# Altium project frontBreakout.PrjPcb
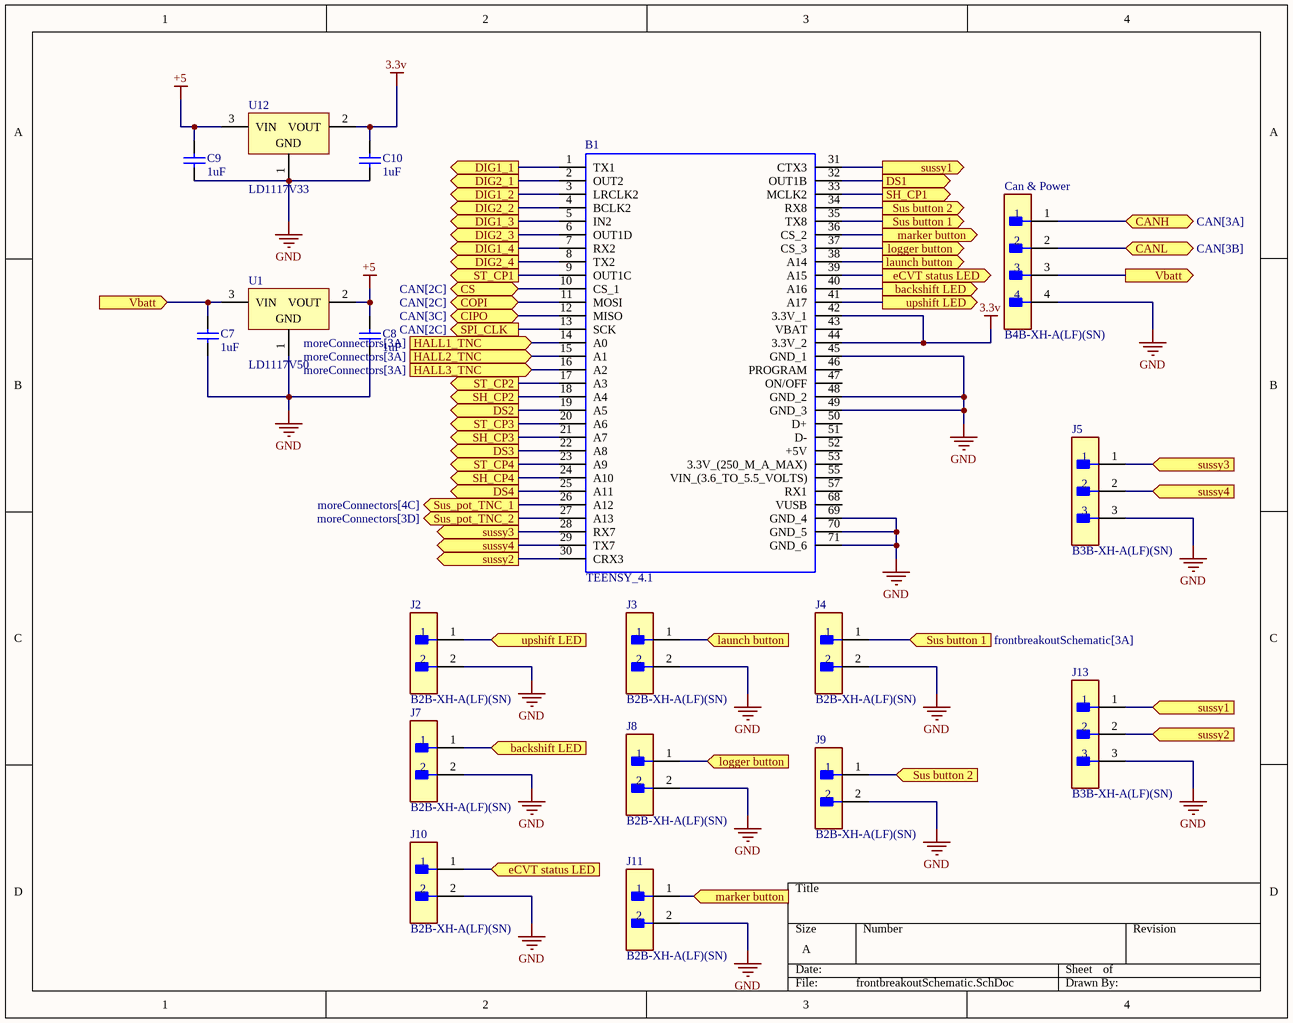
[diagram p0: frontbreakoutSchematic.SchDoc]
5 sheets, 90 parts. Net scope: flat (ports and power ports of the same name join across sheets).
Board file: frontbreakoutPCB.PcbDoc
Sheets:
  frontbreakoutSchematic.SchDoc
  CAN.SchDoc
  ssegs_and_registers.SchDoc
  SEX.SchDoc
  moreConnectors.SchDoc

## Sheet frontbreakoutSchematic.SchDoc
size A; SheetNumber: 1; SheetTotal: 5

### Parts
B1  TEENSY_4.1  [TEENSY41]
C7  1uF  [CAPC2013X145X50LL20T25]
C8  1uF  [CAPC2013X145X50LL20T25]
C9  1uF  [CAPC2013X145X50LL20T25]
C10  1uF  [CAPC2013X145X50LL20T25]
Can_&_Power  B4B-XH-A(LF)(SN)  [FP-B4B-XH-A_LF_SN-MFG]
J2  B2B-XH-A(LF)(SN)  [FP-B2B-XH-A_LF_SN-MFG]
J3  B2B-XH-A(LF)(SN)  [FP-B2B-XH-A_LF_SN-MFG]
J4  B2B-XH-A(LF)(SN)  [FP-B2B-XH-A_LF_SN-MFG]
J5  B3B-XH-A(LF)(SN)  [FP-B3B-XH-A_LF_SN-MFG]
J7  B2B-XH-A(LF)(SN)  [FP-B2B-XH-A_LF_SN-MFG]
J8  B2B-XH-A(LF)(SN)  [FP-B2B-XH-A_LF_SN-MFG]
J9  B2B-XH-A(LF)(SN)  [FP-B2B-XH-A_LF_SN-MFG]
J10  B2B-XH-A(LF)(SN)  [FP-B2B-XH-A_LF_SN-MFG]
J11  B2B-XH-A(LF)(SN)  [FP-B2B-XH-A_LF_SN-MFG]
J13  B3B-XH-A(LF)(SN)  [FP-B3B-XH-A_LF_SN-MFG]
U1  LD1117V50  [TO220]
U12  LD1117V33  [TO220]

### Ports
backshift LED (in, see frontbreakoutSchematic[3B]), backshift LED (out, see frontbreakoutSchematic[2C]), CANH (bidir, see CAN[3A]), CANL (bidir, see CAN[3B]), CIPO (bidir, see CAN[3C]), COPI (bidir, see CAN[2C]), CS (bidir, see CAN[2C]), DIG1_1 (out, see SEX[3A]), DIG1_2 (out, see SEX[3C]), DIG1_3 (out, see SEX[2B]), DIG1_4 (out, see SEX[3C]), DIG2_1 (out, see SEX[1A]), DIG2_2 (out, see SEX[1C]), DIG2_3 (out, see SEX[1B]), DIG2_4 (out, see SEX[1C]), DS1 (out, see ssegs_and_registers[1A]), DS2 (out, see ssegs_and_registers[1C]), DS3 (out, see ssegs_and_registers[3A]), DS4 (out, see ssegs_and_registers[3C]), eCVT status LED (in, see frontbreakoutSchematic[3B]), eCVT status LED (out, see frontbreakoutSchematic[2D]), HALL1_TNC (in, see moreConnectors[3A]), HALL2_TNC (in, see moreConnectors[3A]), HALL3_TNC (in, see moreConnectors[3A]), launch button (in, see frontbreakoutSchematic[3B]), launch button (out, see frontbreakoutSchematic[3C]), logger button (in, see frontbreakoutSchematic[3A]), logger button (out, see frontbreakoutSchematic[3C]), marker button (in, see frontbreakoutSchematic[3A]), marker button (out, see frontbreakoutSchematic[3D]), SH_CP1 (out, see ssegs_and_registers[1A]), SH_CP2 (out, see ssegs_and_registers[1C]), SH_CP3 (out, see ssegs_and_registers[3A]), SH_CP4 (out, see ssegs_and_registers[3C]), SPI_CLK (out, see CAN[2C]), ST_CP1 (out, see ssegs_and_registers[1A]), ST_CP2 (out, see ssegs_and_registers[1B]), ST_CP3 (out, see ssegs_and_registers[3A]), ST_CP4 (out, see ssegs_and_registers[3B]), Sus button 1 (in, see frontbreakoutSchematic[3A]), Sus button 1 (out, see frontbreakoutSchematic[3C]), Sus button 2 (in, see frontbreakoutSchematic[3A]), Sus button 2 (out, see frontbreakoutSchematic[3D]), Sus_pot_TNC_1 (out, see moreConnectors[4C]), Sus_pot_TNC_2 (out, see moreConnectors[3D]), sussy1 (in, see frontbreakoutSchematic[3A]), sussy1 (out, see frontbreakoutSchematic[4C]), sussy2 (in, see frontbreakoutSchematic[2C]), sussy2 (out, see frontbreakoutSchematic[4C]), sussy3 (in, see frontbreakoutSchematic[2C]), sussy3 (out, see frontbreakoutSchematic[4B]), sussy4 (in, see frontbreakoutSchematic[2C]), sussy4 (out, see frontbreakoutSchematic[4B]), upshift LED (in, see frontbreakoutSchematic[3B]), upshift LED (out, see frontbreakoutSchematic[2C]), Vbatt (in, see frontbreakoutSchematic[4B], moreConnectors[1A], moreConnectors[2B], moreConnectors[3A]), Vbatt (out, see frontbreakoutSchematic[1B], moreConnectors[1A], moreConnectors[2B], moreConnectors[3A])

### Nets
3.3v: B1.42(3.3V_1) B1.44(3.3V_2) C10.2 U12.2(VOUT)
+5: C8.2 C9.2 U1.2(VOUT) U12.3(VIN)
GND: B1.45(GND_1) B1.48(GND_2) B1.49(GND_3) B1.69(GND_4) B1.70(GND_5) B1.71(GND_6) C7.1 C8.1 C9.1 C10.1 Can_&_Power.4 J2.2 J3.2 J4.2 J5.3 J7.2 J8.2 J9.2 J10.2 J11.2 J13.3 U1.1(GND) U12.1(GND)
HALL1_TNC: B1.14(A0) ; port HALL1_TNC
HALL2_TNC: B1.15(A1) ; port HALL2_TNC
HALL_TNC: B1.16(A2) ; port HALL3_TNC
Sus_Pot_TNC_1: B1.26(A12) ; port Sus_pot_TNC_1
Sus_pot_TNC_2: B1.27(A13) ; port Sus_pot_TNC_2
NetB1_1: B1.1(TX1) ; port DIG1_1
NetB1_2: B1.2(OUT2) ; port DIG2_1
NetB1_3: B1.3(LRCLK2) ; port DIG1_2
NetB1_4: B1.4(BCLK2) ; port DIG2_2
NetB1_5: B1.5(IN2) ; port DIG1_3
NetB1_6: B1.6(OUT1D) ; port DIG2_3
NetB1_7: B1.7(RX2) ; port DIG1_4
NetB1_8: B1.8(TX2) ; port DIG2_4
NetB1_9: B1.9(OUT1C) ; port ST_CP1
NetB1_10: B1.10(CS_1) ; port CS
NetB1_11: B1.11(MOSI) ; port COPI
NetB1_12: B1.12(MISO) ; port CIPO
NetB1_13: B1.13(SCK) ; port SPI_CLK
NetB1_17: B1.17(A3) ; port ST_CP2
NetB1_18: B1.18(A4) ; port SH_CP2
NetB1_19: B1.19(A5) ; port DS2
NetB1_20: B1.20(A6) ; port ST_CP3
NetB1_21: B1.21(A7) ; port SH_CP3
NetB1_22: B1.22(A8) ; port DS3
NetB1_23: B1.23(A9) ; port ST_CP4
NetB1_24: B1.24(A10) ; port SH_CP4
NetB1_25: B1.25(A11) ; port DS4
NetB1_28: B1.28(RX7) J5.1 ; port sussy3
NetB1_29: B1.29(TX7) J5.2 ; port sussy4
NetB1_30: B1.30(CRX3) J13.2 ; port sussy2
NetB1_31: B1.31(CTX3) J13.1 ; port sussy1
NetB1_32: B1.32(OUT1B) ; port DS1
NetB1_33: B1.33(MCLK2) ; port SH_CP1
NetB1_34: B1.34(RX8) J9.1 ; port Sus button 2
NetB1_35: B1.35(TX8) J4.1 ; port Sus button 1
NetB1_36: B1.36(CS_2) J11.1 ; port marker button
NetB1_37: B1.37(CS_3) J8.1 ; port logger button
NetB1_38: B1.38(A14) J3.1 ; port launch button
NetB1_39: B1.39(A15) J10.1 ; port eCVT status LED
NetB1_40: B1.40(A16) J7.1 ; port backshift LED
NetB1_41: B1.41(A17) J2.1 ; port upshift LED
NetC7_2: C7.2 Can_&_Power.3 U1.3(VIN) ; port Vbatt
NetCan_&_Power_1: Can_&_Power.1 ; port CANH
NetCan_&_Power_2: Can_&_Power.2 ; port CANL

Not connected (* = marked no-connect by the designer): B1 43(VBAT) 46(PROGRAM) 47(ON/OFF) 50(D+) 51(D-) 52(+5V) 53(3.3V_(250_M_A_MAX)) 55(VIN_(3.6_TO_5.5_VOLTS)) 57(RX1) 68(VUSB)

### Library data of the parts
B1 = TEENSY_4.1: Teensy 4.1 Development Board; Manufacturer_Name: PJRC; Manufacturer_Part_Number: TEENSY 4.1; Mouser Part Number: *; Mouser Price/Stock: *; Arrow Part Number: *; Arrow Price/Stock: *; Mouser Testing Part Number: *; Mouser Testing Price/Stock: *; Datasheet Link: https://www.pjrc.com/store/teensy41.html
C7-C10 = CMP-1036-04746-2: C0805C105K4PACTU; Manufacturer: Kemet; Part Number: C0805C105K4PACTU
Can_&_Power = CMP-17439-000250-1: CONN HEADER VERT 4POS 2.5MM; Number of Contacts: 4; Contact Resistance: 20mR; Voltage Rating: 250V; Max Current Rating: 3A; Gender: Male; Wire/Cable Gauge: 22AWG; Mated Stacking Heights: 9.8mm; Insulation Resistance: 1GR; Orientation: Straight; Contact Type: Male Pin; Contact Finish - Mating: TIN; Series: XH; Max Voltage Rating (AC): 250V; Lead Pitch: 2.5mm; Contact Shape: Square; Insulation Color: Natural; Termination: Solder; Lead Free: Lead Free; Voltage Rating (AC): 250V; Number of Rows: 1; Flammability Rating: UL94 V-0; Number of Positions: 4; Max Operating Temperature: 85°C; Package Quantity: 500; Mount: Through Hole; REACH SVHC: No SVHC; Connector Type: Header; Insulation Material: Nylon; Fastening Type: Detent; Min Operating Temperature: -25°C; Housing Color: White; Packaging: Bulk; Contact Plating: Tin; Contact Material: Brass; Max Voltage Rating (DC): 250V; Housing Material: Polyamide; Color: Natural; Material: Polyamide; Pitch: 2.5mm; Depth: 5.75mm; Current Rating: 3A; Length: 12.4mm
J2-J4 J7-J11 = CMP-2000-05888-3: CONN HEADER VERT 2POS 2.5MM; Current Rating: 3A; Voltage Rating: 250V; Number of Contacts: 2; Contact Resistance: 20mR; Wire/Cable Gauge: 22AWG; Insulation Resistance: 1GR; Connector Type: Male Pin; Packaging: Bulk; Contact Material: Brass; Lead Free: Lead Free; Orientation: Straight; Contact Plating: Tin; Max Current Rating: 3A; Termination: Solder; Fastening Type: Detent; Depth: 5.75mm; Housing Material: Polyamide; REACH SVHC: No SVHC; Series: XH; Voltage Rating (AC): 250V; Number of Positions: 2; Color: Natural; Contact Type: Male Pin; Max Voltage Rating (DC): 250V; Pitch: 2.5mm; Lead Pitch: 2.5mm; Mount: Through Hole; Max Operating Temperature: 85°C; Length: 7.4mm; Max Voltage Rating (AC): 250V; Min Operating Temperature: -25°C; Number of Rows: 1; Housing Color: White
J5 J13 = CMP-17439-000014-3: CONN HEADER VERT 3POS 2.5MM; Max Voltage Rating (DC): 250V; Number of Positions: 3; Current Rating: 3A; Gender: Male; Wire/Cable Gauge: 22AWG; Contact Resistance: 20mR; Insulation Resistance: 1GR; Insulation Material: Nylon; Contact Plating: Tin; Depth: 5.75mm; Contact Type: Male Pin; Max Operating Temperature: 85°C; Insulation Color: Natural; Voltage Rating (AC): 250V; Color: Natural; Connector Type: Header; Orientation: Straight; Fastening Type: Detent; Housing Color: White; Min Operating Temperature: -25°C; Termination: Solder; Voltage Rating: 250V; Series: XH; Pitch: 2.5mm; Contact Shape: Square; Number of Rows: 1; Lead Free: Lead Free; Packaging: Bulk; Mount: Through Hole; Flammability Rating: UL94 V-0; Max Voltage Rating (AC): 250V; REACH SVHC: No SVHC; Housing Material: Polyamide; Contact Material: Brass; Lead Pitch: 2.5mm; Contact Finish - Mating: TIN; Length: 9.9mm; Max Current Rating: 3A; Number of Contacts: 3
U1 = CMP-0244-00472-1: Fixed Low Drop Positive Voltage Regulator, 5V, 3-Pin TO-220; ComponentLink1URL: http://www.st.com; ComponentLink1Description: Manufacturer URL; DatasheetVersion: 1/11/2011; PackageDescription: TO, Thru-Hole, Vertical, Heatsink Mounted; 3 In-Line Leads; Pitch 2.54 mm; ComponentLink2Description: Datasheet; ComponentLink3URL: http://www.st.com/internet/com/TECHNICAL_RESOURCES/TECHNICAL_LITERATURE/PACKAGE_INFORMATION/CD00004649.pdf; PackageVersion: ver3.0; PackageReference: TO220; ComponentLink2URL: http://www.st.com/internet/com/TECHNICAL_RESOURCES/TECHNICAL_LITERATURE/DATASHEET/CD00000544.pdf; ComponentLink3Description: Package Specification
U12 = CMP-0244-00470-1: Fixed Low Drop Positive Voltage Regulator, 3.3V, 3-Pin TO-220; PackageVersion: ver3.0; PackageDescription: TO, Thru-Hole, Vertical, Heatsink Mounted; 3 In-Line Leads; Pitch 2.54 mm; ComponentLink1Description: Manufacturer URL; ComponentLink3URL: http://www.st.com/internet/com/TECHNICAL_RESOURCES/TECHNICAL_LITERATURE/PACKAGE_INFORMATION/CD00004649.pdf; PackageReference: TO220; ComponentLink2URL: http://www.st.com/internet/com/TECHNICAL_RESOURCES/TECHNICAL_LITERATURE/DATASHEET/CD00000544.pdf; ComponentLink3Description: Package Specification; ComponentLink2Description: Datasheet; ComponentLink1URL: http://www.st.com; DatasheetVersion: 1/11/2011

## Sheet CAN.SchDoc
size A; SheetNumber: 2; SheetTotal: 5
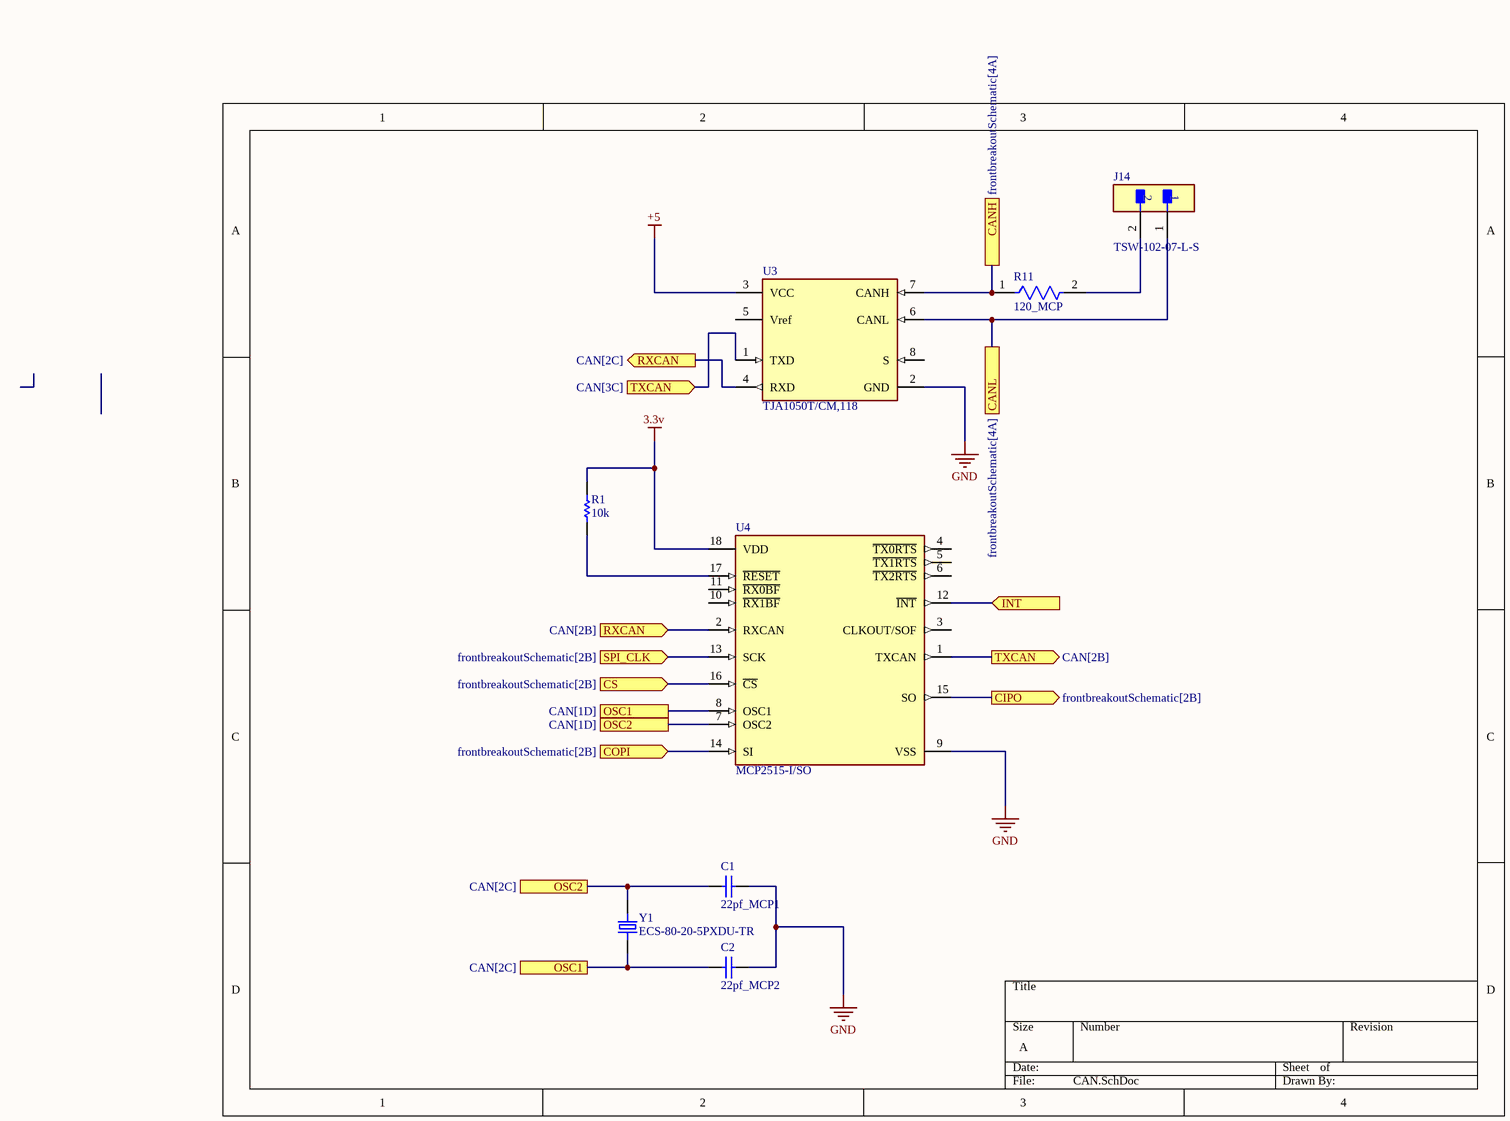
[diagram p1: CAN.SchDoc]

### Parts
C1  22pf_MCP1  [CAPC2013X145X50NL20T20]
C2  22pf_MCP2  [CAPC2013X145X50NL20T20]
J14  TSW-102-07-L-S  [FP-TSW-102-07-L-S-MFG]
R1  10k  [RESC3116X65X50NL20T20]
R11  120_MCP  [FP-CRCW0805-e3-IPC_C]
U3  TJA1050T/CM,118  [FP-SOT96-1-IPC_A]
U4  MCP2515-I/SO  [FP-C04-051-MFG]
Y1  ECS-80-20-5PXDU-TR  [XTAL_ECS-80-20-5PXDU-TR]

### Ports
CANH (see frontbreakoutSchematic[4A]), CANL (see frontbreakoutSchematic[4A]), CIPO (out, see frontbreakoutSchematic[2B]), COPI (in, see frontbreakoutSchematic[2B]), CS (in, see frontbreakoutSchematic[2B]), INT (in), OSC1 (see CAN[1D]), OSC1 (see CAN[2C]), OSC2 (see CAN[1D]), OSC2 (see CAN[2C]), RXCAN (in, see CAN[2B]), RXCAN (out, see CAN[2C]), SPI_CLK (in, see frontbreakoutSchematic[2B]), TXCAN (in, see CAN[3C]), TXCAN (out, see CAN[2B])

### Nets
3.3v: R1.2 U4.18(VDD)
+5: U3.3(VCC)
GND: C1.2 C2.2 U3.2(GND) U4.9(VSS)
NetB1_10: U4.16(~{CS}) ; port CS
NetB1_11: U4.14(SI) ; port COPI
NetB1_12: U4.15(SO) ; port CIPO
NetB1_13: U4.13(SCK) ; port SPI_CLK
NetC1_1: C1.1 U4.7(OSC2) Y1.2 ; port OSC2
NetC2_1: C2.1 U4.8(OSC1) Y1.1 ; port OSC1
NetCan_&_Power_1: R11.1 U3.7(CANH) ; port CANH
NetCan_&_Power_2: J14.1 U3.6(CANL) ; port CANL
NetJ14_2: J14.2 R11.2
NetR1_1: R1.1 U4.17(~{RESET})
NetU3_1: U3.1(TXD) U4.1(TXCAN) ; port TXCAN
NetU3_4: U3.4(RXD) U4.2(RXCAN) ; port RXCAN
NetU4_12: U4.12(~{INT}) ; port INT

Not connected (* = marked no-connect by the designer): U3 5(Vref) 8(S); U4 3(CLKOUT/SOF) 4(~{TX0RTS}) 5(~{TX1RTS}) 6(~{TX2RTS}) 10(~{RX1BF}) 11(~{RX0BF})

### Library data of the parts
C1 C2 = CMP-1036-01227-2: Manufacturer: Vitramon; Part Number: VJ0805A220GXXCW1BC
J14 = CMP-02766-001428-1: CONN HEADER VERT 2POS 2.54MM; Voltage Rating: 550V; Current Rating: 7.6A; Gender: Male; Number of Contacts: 2; Connector Type: Male Pin; Radiation Hardening: No; Orientation: Straight; Contact Plating: Gold; Max Operating Temperature: 125°C; Mount: Through Hole; Package Quantity: 1; Number of Rows: 1; Housing Material: Polyester; RoHS Compliant: Yes; Length: 5.08mm; Max Voltage Rating (AC): 550V; Pitch: 2.54mm; Packaging: Bulk; Depth: 2.54mm; Termination: Solder; Min Operating Temperature: -55°C; Housing Color: Black; Lead Free: Lead Free; Color: Black; Number of Positions: 2; Width: 2.54mm; Max Current Rating: 7.6A; REACH SVHC: No SVHC; Contact Material: Bronze; Contact Mating Length: 0.23inch; Series: TSW; Contact Type: Male Pin
R1 = CMP-2003-04883-1: CRCW120610K0FKEAHP; Manufacturer: Vishay Dale; Part Number: CRCW120610K0FKEAHP
R11 = CMP-02407-009256-1: RES Thick Film, 4.02Ω, 1%, 0.125W, 200ppm/°C, 0805; Resistance: 4.02R; Power Rating: 125mW; Voltage Rating: 150V; Features: Automotive AEC-Q200; Weight: 0.000194oz; Height: 0.02inch; Case Code (Metric): 2012; Composition: Thick Film; Temperature Coefficient: 200ppm/°C; Case/Package: 0805; Min Operating Temperature: -55°C; Width: 0.049inch; Contact Plating: Tin; Packaging: Tape and Reel; Tolerance: 1%; Length: 0.079inch; Lead Free: Lead Free; Case Code (Imperial): 0805; Package Quantity: 5000; Radiation Hardening: No; Max Operating Temperature: 155°C; Number of Terminations: 2; Max Power Dissipation: 125mW; Voltage Rating (DC): 150V
U3 = CMP-2000-04923-2: IC TRANSCEIVER HALF 1/1 8SO; Simplex/Duplex: Half Duplex; Max Supply Current: 10mA; Number of Receive Buffers: 1; Min Supply Voltage: 4.75V; Max Supply Voltage: 5.25V; Interface: CAN; Data Rate: 1Mbps; Receiver Hysteresis: 70mV; Number of Transmit Buffers: 1; Min Operating Temperature: -40°C; Case/Package: SO; REACH SVHC: No SVHC; Max Operating Temperature: 150°C; Number of Pins: 8; Lead Free: Lead Free; Number of Transceivers: 1; Packaging: Tape and Reel; Mount: Surface Mount; Radiation Hardening: No; Nominal Supply Current: 10mA; Package Quantity: 2500; Contact Plating: Gold
U4 = CMP-0186-00133-3: IC CAN CONTROLLER W/SPI 18SOIC; Manufacturer: Microchip; Min Supply Voltage: 2.7V; Max Supply Voltage: 5.5V; Standoff Height: 0.1mm; Nominal Supply Current: 10mA; Interface: SPI,CAN; Lead Free: Yes; Digikey Description: IC CAN CONTROLLER W/SPI 18SOIC; Category: IC; RoHS: TRUE; Manufacturer Part Number: MCP2515-I/SO; ComponentLink2URL: http://ww1.microchip.com/downloads/en/DeviceDoc/MCP2515-Stand-Alone-CAN-Controller-with-SPI-20001801J.pdf; Mouser Description: CAN Interface IC W/ SPI Interface; Device Class L2: Interface ICs; Package: C04-051; Automotive: No; Function: Controller; Octopart: https://octopart.com/mcp2515-i%2Fso-microchip-430187; Temperature: -40°C to +85°C; Ipc Land Pattern Name: SOIC127P1030X265-18; Ambient Temperature Range Low: -65°C; Height: 2.65mm; Device Class L1: Integrated Circuits (ICs); Ambient Temperature Range High: +125°C; Footprint Url: http://ww1.microchip.com/downloads/en/DeviceDoc/18L_SOIC_Wide_7.50_SO_C04-0051D.pdf; Temperature Range Low: -40°C; Device Class L3: Controllers; Temperature Range High: +85°C; ComponentLink2Description: Datasheet
Y1 = ECS-80-20-5PXDU-TR: 8MHz Â±30ppm Crystal 20pF 60 Ohms HC-49/US; MF: ECS Inc.; Package: HC49/US ECS International; Availability: Unavailable; Value: *; MP: ECS-80-20-5PXDU-TR; SnapEDA_Link: https://www.snapeda.com/parts/ECS-80-20-5PXDU-TR/ECS%20Inc./view-part/584052/?ref=snap; Price: None

## Sheet ssegs_and_registers.SchDoc
size A; SheetNumber: 3; SheetTotal: 4
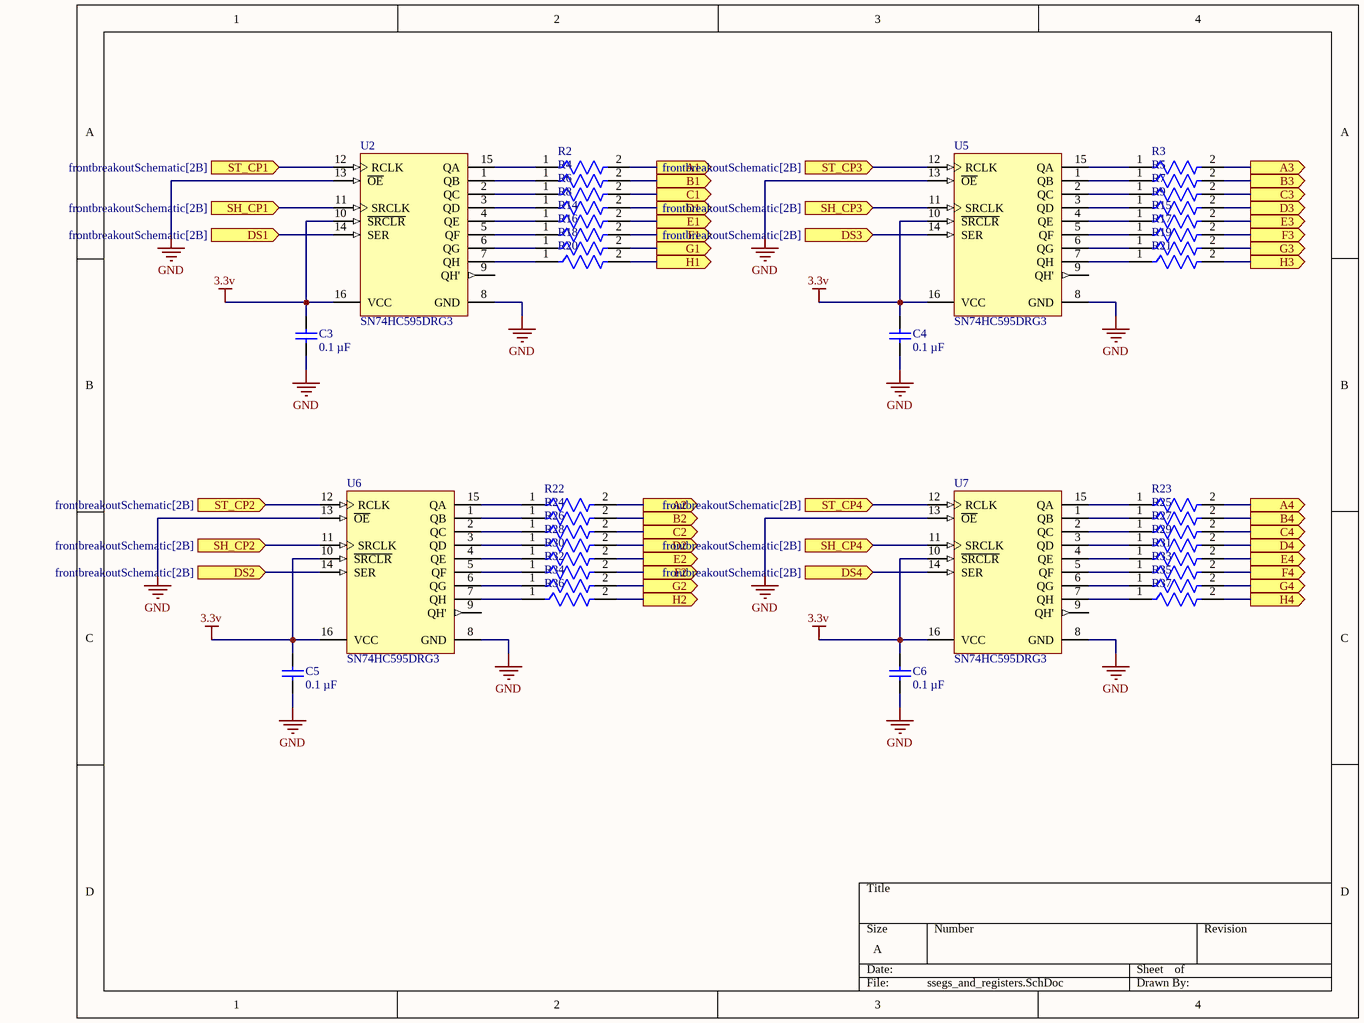
[diagram p2: ssegs_and_registers.SchDoc]

### Parts
C3  0.1 µF  [CAPC2013X140X50NL20T25]
C4  0.1 µF  [CAPC2013X140X50NL20T25]
C5  0.1 µF  [CAPC2013X140X50NL20T25]
C6  0.1 µF  [CAPC2013X140X50NL20T25]
R2  200  [FP-RG2012-IPC_A]  (value not drawn)
R3  200  [FP-RG2012-IPC_A]  (value not drawn)
R4  200  [FP-RG2012-IPC_A]  (value not drawn)
R5  200  [FP-RG2012-IPC_A]  (value not drawn)
R6  200  [FP-RG2012-IPC_A]  (value not drawn)
R7  200  [FP-RG2012-IPC_A]  (value not drawn)
R8  200  [FP-RG2012-IPC_A]  (value not drawn)
R9  200  [FP-RG2012-IPC_A]  (value not drawn)
R14  200  [FP-RG2012-IPC_A]  (value not drawn)
R15  200  [FP-RG2012-IPC_A]  (value not drawn)
R16  200  [FP-RG2012-IPC_A]  (value not drawn)
R17  200  [FP-RG2012-IPC_A]  (value not drawn)
R18  200  [FP-RG2012-IPC_A]  (value not drawn)
R19  200  [FP-RG2012-IPC_A]  (value not drawn)
R20  200  [FP-RG2012-IPC_A]  (value not drawn)
R21  200  [FP-RG2012-IPC_A]  (value not drawn)
R22  200  [FP-RG2012-IPC_A]  (value not drawn)
R23  200  [FP-RG2012-IPC_A]  (value not drawn)
R24  200  [FP-RG2012-IPC_A]  (value not drawn)
R25  200  [FP-RG2012-IPC_A]  (value not drawn)
R26  200  [FP-RG2012-IPC_A]  (value not drawn)
R27  200  [FP-RG2012-IPC_A]  (value not drawn)
R28  200  [FP-RG2012-IPC_A]  (value not drawn)
R29  200  [FP-RG2012-IPC_A]  (value not drawn)
R30  200  [FP-RG2012-IPC_A]  (value not drawn)
R31  200  [FP-RG2012-IPC_A]  (value not drawn)
R32  200  [FP-RG2012-IPC_A]  (value not drawn)
R33  200  [FP-RG2012-IPC_A]  (value not drawn)
R34  200  [FP-RG2012-IPC_A]  (value not drawn)
R35  200  [FP-RG2012-IPC_A]  (value not drawn)
R36  200  [FP-RG2012-IPC_A]  (value not drawn)
R37  200  [FP-RG2012-IPC_A]  (value not drawn)
U2  SN74HC595DRG3  [D0016A_L]
U5  SN74HC595DRG3  [D0016A_L]
U6  SN74HC595DRG3  [D0016A_L]
U7  SN74HC595DRG3  [D0016A_L]

### Ports
A1 (out, see SEX[2A]), A2 (out, see SEX[4A]), A3 (out, see SEX[2B]), A4 (out, see SEX[4B]), B1 (out, see SEX[2A]), B2 (out, see SEX[4A]), B3 (out, see SEX[2B]), B4 (out, see SEX[4B]), C1 (out, see SEX[1A]), C2 (out, see SEX[3A]), C3 (out, see SEX[1B]), C4 (out, see SEX[3B]), D1 (out, see SEX[1A]), D2 (out, see SEX[3A]), D3 (out, see SEX[1B]), D4 (out, see SEX[3B]), DS1 (in, see frontbreakoutSchematic[2B]), DS2 (in, see frontbreakoutSchematic[2B]), DS3 (in, see frontbreakoutSchematic[2B]), DS4 (in, see frontbreakoutSchematic[2B]), E1 (out, see SEX[1A]), E2 (out, see SEX[3A]), E3 (out, see SEX[1B]), E4 (out, see SEX[3B]), F1 (out, see SEX[2A]), F2 (out, see SEX[4A]), F3 (out, see SEX[2B]), F4 (out, see SEX[4B]), G1 (out, see SEX[2A]), G2 (out, see SEX[4A]), G3 (out, see SEX[2B]), G4 (out, see SEX[4B]), H1 (out, see SEX[1A]), H2 (out, see SEX[3A]), H3 (out, see SEX[1B]), H4 (out, see SEX[3B]), SH_CP1 (in, see frontbreakoutSchematic[2B]), SH_CP2 (in, see frontbreakoutSchematic[2B]), SH_CP3 (in, see frontbreakoutSchematic[2B]), SH_CP4 (in, see frontbreakoutSchematic[2B]), ST_CP1 (in, see frontbreakoutSchematic[2B]), ST_CP2 (in, see frontbreakoutSchematic[2B]), ST_CP3 (in, see frontbreakoutSchematic[2B]), ST_CP4 (in, see frontbreakoutSchematic[2B])

### Nets
3.3v: C3.1 C4.1 C5.1 C6.1 U2.10(~{SRCLR}) U2.16(VCC) U5.10(~{SRCLR}) U5.16(VCC) U6.10(~{SRCLR}) U6.16(VCC) U7.10(~{SRCLR}) U7.16(VCC)
GND: C3.2 C4.2 C5.2 C6.2 U2.8(GND) U2.13(~{OE}) U5.8(GND) U5.13(~{OE}) U6.8(GND) U6.13(~{OE}) U7.8(GND) U7.13(~{OE})
NetB1_9: U2.12(RCLK) ; port ST_CP1
NetB1_17: U6.12(RCLK) ; port ST_CP2
NetB1_18: U6.11(SRCLK) ; port SH_CP2
NetB1_19: U6.14(SER) ; port DS2
NetB1_20: U5.12(RCLK) ; port ST_CP3
NetB1_21: U5.11(SRCLK) ; port SH_CP3
NetB1_22: U5.14(SER) ; port DS3
NetB1_23: U7.12(RCLK) ; port ST_CP4
NetB1_24: U7.11(SRCLK) ; port SH_CP4
NetB1_25: U7.14(SER) ; port DS4
NetB1_32: U2.14(SER) ; port DS1
NetB1_33: U2.11(SRCLK) ; port SH_CP1
NetR2_1: R2.1 U2.15(QA)
NetR2_2: R2.2 ; port A1
NetR3_1: R3.1 U5.15(QA)
NetR3_2: R3.2 ; port A3
NetR4_1: R4.1 U2.1(QB)
NetR4_2: R4.2 ; port B1
NetR5_1: R5.1 U5.1(QB)
NetR5_2: R5.2 ; port B3
NetR6_1: R6.1 U2.2(QC)
NetR6_2: R6.2 ; port C1
NetR7_1: R7.1 U5.2(QC)
NetR7_2: R7.2 ; port C3
NetR8_1: R8.1 U2.3(QD)
NetR8_2: R8.2 ; port D1
NetR9_1: R9.1 U5.3(QD)
NetR9_2: R9.2 ; port D3
NetR14_1: R14.1 U2.4(QE)
NetR14_2: R14.2 ; port E1
NetR15_1: R15.1 U5.4(QE)
NetR15_2: R15.2 ; port E3
NetR16_1: R16.1 U2.5(QF)
NetR16_2: R16.2 ; port F1
NetR17_1: R17.1 U5.5(QF)
NetR17_2: R17.2 ; port F3
NetR18_1: R18.1 U2.6(QG)
NetR18_2: R18.2 ; port G1
NetR19_1: R19.1 U5.6(QG)
NetR19_2: R19.2 ; port G3
NetR20_1: R20.1 U2.7(QH)
NetR20_2: R20.2 ; port H1
NetR21_1: R21.1 U5.7(QH)
NetR21_2: R21.2 ; port H3
NetR22_1: R22.1 U6.15(QA)
NetR22_2: R22.2 ; port A2
NetR23_1: R23.1 U7.15(QA)
NetR23_2: R23.2 ; port A4
NetR24_1: R24.1 U6.1(QB)
NetR24_2: R24.2 ; port B2
NetR25_1: R25.1 U7.1(QB)
NetR25_2: R25.2 ; port B4
NetR26_1: R26.1 U6.2(QC)
NetR26_2: R26.2 ; port C2
NetR27_1: R27.1 U7.2(QC)
NetR27_2: R27.2 ; port C4
NetR28_1: R28.1 U6.3(QD)
NetR28_2: R28.2 ; port D2
NetR29_1: R29.1 U7.3(QD)
NetR29_2: R29.2 ; port D4
NetR30_1: R30.1 U6.4(QE)
NetR30_2: R30.2 ; port E2
NetR31_1: R31.1 U7.4(QE)
NetR31_2: R31.2 ; port E4
NetR32_1: R32.1 U6.5(QF)
NetR32_2: R32.2 ; port F2
NetR33_1: R33.1 U7.5(QF)
NetR33_2: R33.2 ; port F4
NetR34_1: R34.1 U6.6(QG)
NetR34_2: R34.2 ; port G2
NetR35_1: R35.1 U7.6(QG)
NetR35_2: R35.2 ; port G4
NetR36_1: R36.1 U6.7(QH)
NetR36_2: R36.2 ; port H2
NetR37_1: R37.1 U7.7(QH)
NetR37_2: R37.2 ; port H4

Not connected (* = marked no-connect by the designer): U2 9(QH'); U5 9(QH'); U6 9(QH'); U7 9(QH')

### Library data of the parts
C3-C6 = CMP-2007-04629-1: Part Number: 08055C104K4Z2A; Manufacturer: AVX Interconnect / Elco
R2-R9 R14-R37 = CMP-2001-02821-2: Automotive Metal Thin Film Chip Resistor, 0805, 200Ω, 0.1%, 25ppm/°C, 0.125W, 150VRG2012P-201-B-T5; Voltage Rating (DC): 150V; Voltage Rating: 100V; Resistance: 200R; Max Power Dissipation: 125mW; Power Rating: 100mW; Termination: SMD/SMT; Size Code: 0805; Tolerance: 0.1%; Length: 2mm; Width: 1.25mm; Case Code (Metric): 2012; Package Quantity: 5000; Temperature Coefficient: 25ppm/°C; Case/Package: 0805; Packaging: Tape and Reel; Max Operating Temperature: 155°C; Lead Free: Lead Free; RoHS Compliant: Yes; Height: 0.4mm; Series: RG; Case Code (Imperial): 0805; Number of Terminations: 2; Min Operating Temperature: -55°C; Features: Automotive AEC-Q200
U2 U5-U7 = CMP-0780-00040-3: 8-Bit Shift Registers With 3-State Output Registers, D0016A, LARGE T&R; Manufacturer: Texas Instruments; F @ Nom Voltage(Max)(Mhz): 28; Input Type: CMOS; Rating: Military; VCC(Max)(V): 6; VCC(Min)(V): 2; Technology Family: HC; 3-State Output: Yes; tpd @ Nom Voltage(Max)(ns): 34; ICC @ Nom Voltage(Max)(mA): 0.08; Output Drive (IOL/IOH)(Max)(mA): 7.8/-7.8; Bits: 8; DatasheetVersion: SCLS041H; Operating Temperature Range(C): -40 to 85; Code_JEDEC: MS-012 variation AC; Voltage(Nom)(V): 6; Output Type: CMOS; PackageVersion: http://www.ti.com/lit/ml/mpds178g/mpds178g.pdf; Generic Part Number: SN74HC595; PackageReference: D0016A

## Sheet SEX.SchDoc
size A; SheetNumber: 4; SheetTotal: 4
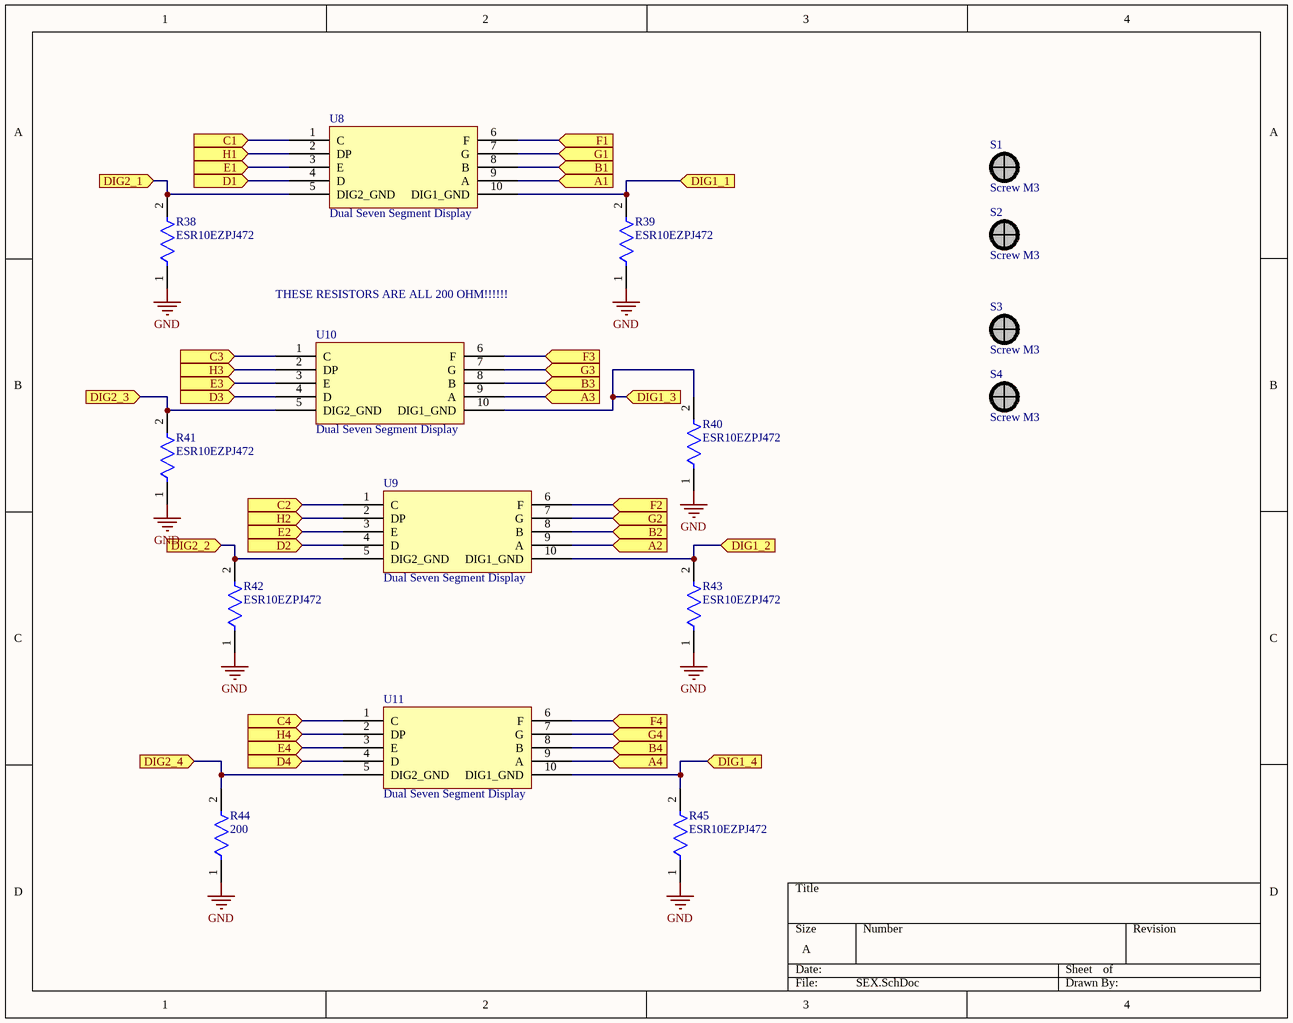
[diagram p3: SEX.SchDoc]

### Parts
R38  ESR10EZPJ472  [FP-ESR10-IPC_B]
R39  ESR10EZPJ472  [FP-ESR10-IPC_B]
R40  ESR10EZPJ472  [FP-ESR10-IPC_B]
R41  ESR10EZPJ472  [FP-ESR10-IPC_B]
R42  ESR10EZPJ472  [FP-ESR10-IPC_B]
R43  ESR10EZPJ472  [FP-ESR10-IPC_B]
R44  200  [FP-ESR10-IPC_B]
R45  ESR10EZPJ472  [FP-ESR10-IPC_B]
S1  Screw M3  [Screw M3]
S2  Screw M3  [Screw M3]
S3  Screw M3  [Screw M3]
S4  Screw M3  [Screw M3]
U8  Dual Seven Segment Display  [DIP10]
U9  Dual Seven Segment Display  [DIP10]
U10  Dual Seven Segment Display  [DIP10]
U11  Dual Seven Segment Display  [DIP10]

### Ports
A1 (in, see ssegs_and_registers[2A]), A2 (in, see ssegs_and_registers[2B]), A3 (in, see ssegs_and_registers[4A]), A4 (in, see ssegs_and_registers[4B]), B1 (in, see ssegs_and_registers[2A]), B2 (in, see ssegs_and_registers[2C]), B3 (in, see ssegs_and_registers[4A]), B4 (in, see ssegs_and_registers[4C]), C1 (in, see ssegs_and_registers[2A]), C2 (in, see ssegs_and_registers[2C]), C3 (in, see ssegs_and_registers[4A]), C4 (in, see ssegs_and_registers[4C]), D1 (in, see ssegs_and_registers[2A]), D2 (in, see ssegs_and_registers[2C]), D3 (in, see ssegs_and_registers[4A]), D4 (in, see ssegs_and_registers[4C]), DIG1_1 (in, see frontbreakoutSchematic[2A]), DIG1_2 (in, see frontbreakoutSchematic[2A]), DIG1_3 (in, see frontbreakoutSchematic[2A]), DIG1_4 (in, see frontbreakoutSchematic[2A]), DIG2_1 (in, see frontbreakoutSchematic[2A]), DIG2_2 (in, see frontbreakoutSchematic[2A]), DIG2_3 (in, see frontbreakoutSchematic[2A]), DIG2_4 (in, see frontbreakoutSchematic[2B]), E1 (in, see ssegs_and_registers[2A]), E2 (in, see ssegs_and_registers[2C]), E3 (in, see ssegs_and_registers[4A]), E4 (in, see ssegs_and_registers[4C]), F1 (in, see ssegs_and_registers[2A]), F2 (in, see ssegs_and_registers[2C]), F3 (in, see ssegs_and_registers[4A]), F4 (in, see ssegs_and_registers[4C]), G1 (in, see ssegs_and_registers[2A]), G2 (in, see ssegs_and_registers[2C]), G3 (in, see ssegs_and_registers[4A]), G4 (in, see ssegs_and_registers[4C]), H1 (in, see ssegs_and_registers[2B]), H2 (in, see ssegs_and_registers[2C]), H3 (in, see ssegs_and_registers[4B]), H4 (in, see ssegs_and_registers[4C])

### Nets
GND: R38.1 R39.1 R40.1 R41.1 R42.1 R43.1 R44.1 R45.1
NetB1_1: R39.2 U8.10(DIG1_GND) ; port DIG1_1
NetB1_2: R38.2 U8.5(DIG2_GND) ; port DIG2_1
NetB1_3: R43.2 U9.10(DIG1_GND) ; port DIG1_2
NetB1_4: R42.2 U9.5(DIG2_GND) ; port DIG2_2
NetB1_5: R40.2 U10.10(DIG1_GND) ; port DIG1_3
NetB1_6: R41.2 U10.5(DIG2_GND) ; port DIG2_3
NetB1_7: R45.2 U11.10(DIG1_GND) ; port DIG1_4
NetB1_8: R44.2 U11.5(DIG2_GND) ; port DIG2_4
NetR2_2: U8.9(A) ; port A1
NetR3_2: U10.9(A) ; port A3
NetR4_2: U8.8(B) ; port B1
NetR5_2: U10.8(B) ; port B3
NetR6_2: U8.1(C) ; port C1
NetR7_2: U10.1(C) ; port C3
NetR8_2: U8.4(D) ; port D1
NetR9_2: U10.4(D) ; port D3
NetR14_2: U8.3(E) ; port E1
NetR15_2: U10.3(E) ; port E3
NetR16_2: U8.6(F) ; port F1
NetR17_2: U10.6(F) ; port F3
NetR18_2: U8.7(G) ; port G1
NetR19_2: U10.7(G) ; port G3
NetR20_2: U8.2(DP) ; port H1
NetR21_2: U10.2(DP) ; port H3
NetR22_2: U9.9(A) ; port A2
NetR23_2: U11.9(A) ; port A4
NetR24_2: U9.8(B) ; port B2
NetR25_2: U11.8(B) ; port B4
NetR26_2: U9.1(C) ; port C2
NetR27_2: U11.1(C) ; port C4
NetR28_2: U9.4(D) ; port D2
NetR29_2: U11.4(D) ; port D4
NetR30_2: U9.3(E) ; port E2
NetR31_2: U11.3(E) ; port E4
NetR32_2: U9.6(F) ; port F2
NetR33_2: U11.6(F) ; port F4
NetR34_2: U9.7(G) ; port G2
NetR35_2: U11.7(G) ; port G4
NetR36_2: U9.2(DP) ; port H2
NetR37_2: U11.2(DP) ; port H4

### Notes on the sheet
- THESE RESISTORS ARE ALL 200 OHM!!!!!!

### Library data of the parts
R38-R45 = CMP-08839-001245-1: 4.7kΩ ±5% 0.4W 0805 Anti-Surge Chip Resistor AEC-Q200; Resistance: 4.7kR; Power Rating: 400mW; Temperature Coefficient: 200ppm/°C; Size Code: 0805; Lead Free: Lead Free; Max Power Dissipation: 400mW; Case/Package: 0805; Number of Terminations: 2; Features: Automotive AEC-Q200; Case Code (Imperial): 0805; RoHS Compliant: Yes; Tolerance: 5%; Packaging: Tape and Reel; Case Code (Metric): 2012; Series: ESR
U8-U11 = Component_1

## Sheet moreConnectors.SchDoc
size A; SheetNumber: 5; SheetTotal: 5
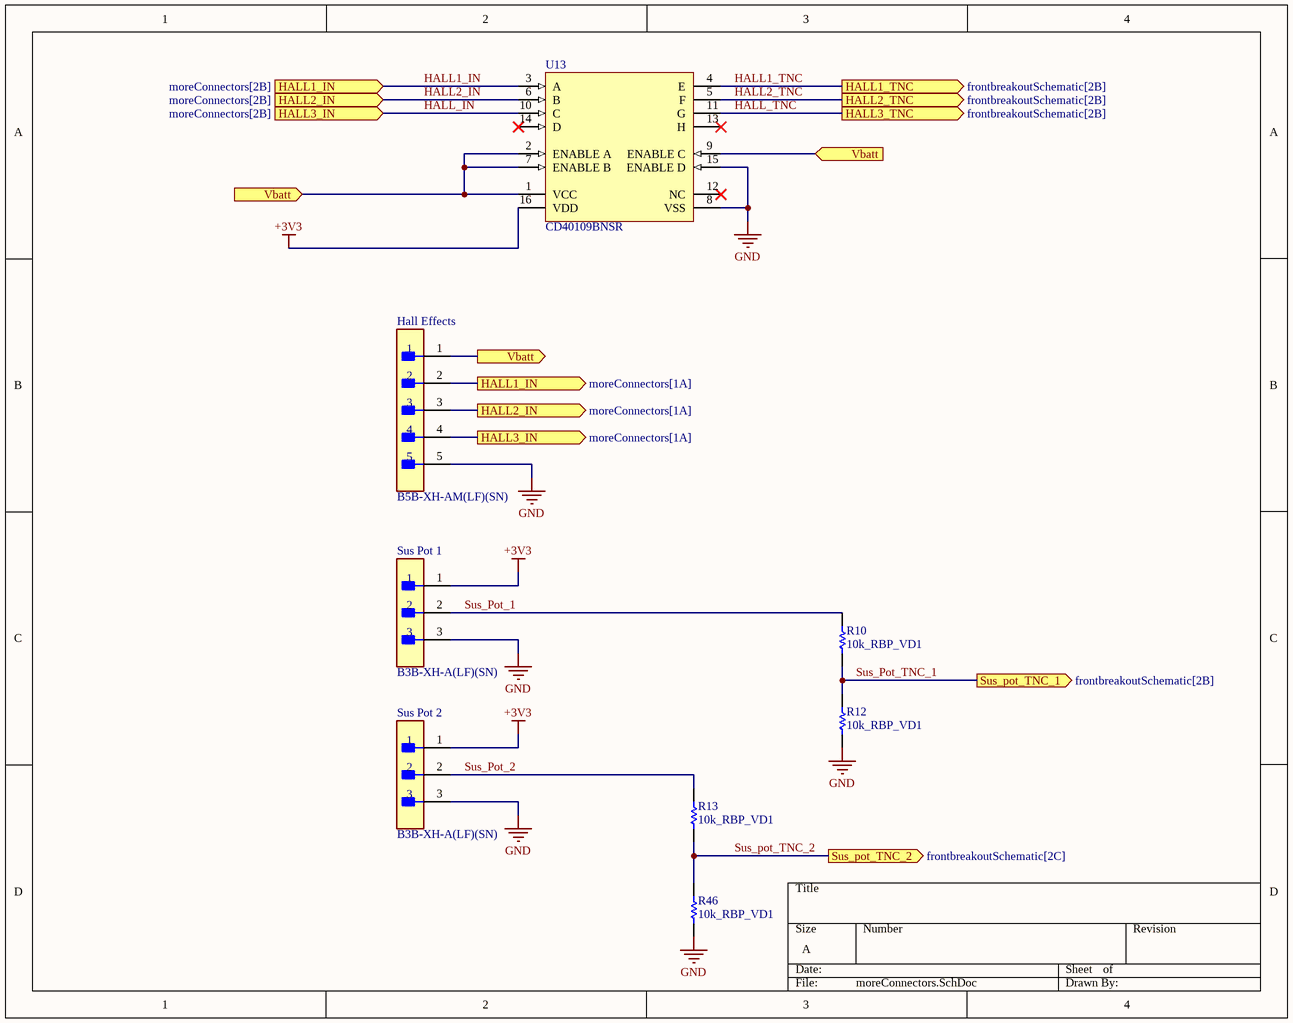
[diagram p4: moreConnectors.SchDoc]

### Parts
Hall_Effects  B5B-XH-AM(LF)(SN)  [FP-B5B-XH-AM_LF_SN-MFG]
R10  10k_RBP_VD1  [RESC2013X60X40LL20T25]
R12  10k_RBP_VD1  [RESC2013X60X40LL20T25]
R13  10k_RBP_VD1  [RESC2013X60X40LL20T25]
R46  10k_RBP_VD1  [RESC2013X60X40LL20T25]
Sus_Pot_1  B3B-XH-A(LF)(SN)  [FP-B3B-XH-A_LF_SN-MFG]
Sus_Pot_2  B3B-XH-A(LF)(SN)  [FP-B3B-XH-A_LF_SN-MFG]
U13  CD40109BNSR  [NS0016A_N]

### Ports
HALL1_IN (in, see moreConnectors[2B]), HALL1_IN (out, see moreConnectors[1A]), HALL1_TNC (out, see frontbreakoutSchematic[2B]), HALL2_IN (in, see moreConnectors[2B]), HALL2_IN (out, see moreConnectors[1A]), HALL2_TNC (out, see frontbreakoutSchematic[2B]), HALL3_IN (in, see moreConnectors[2B]), HALL3_IN (out, see moreConnectors[1A]), HALL3_TNC (out, see frontbreakoutSchematic[2B]), Sus_pot_TNC_1 (out, see frontbreakoutSchematic[2B]), Sus_pot_TNC_2 (out, see frontbreakoutSchematic[2C]), Vbatt (in, see frontbreakoutSchematic[1B], frontbreakoutSchematic[4B], moreConnectors[1A], moreConnectors[2B]), Vbatt (in, see frontbreakoutSchematic[1B], frontbreakoutSchematic[4B], moreConnectors[2B], moreConnectors[3A]), Vbatt (out, see frontbreakoutSchematic[1B], frontbreakoutSchematic[4B], moreConnectors[1A], moreConnectors[3A])

### Nets
+3V3: Sus_Pot_1.1 Sus_Pot_2.1 U13.16(VDD)
GND: Hall_Effects.5 R12.1 R46.1 Sus_Pot_1.3 Sus_Pot_2.3 U13.8(VSS) U13.15(ENABLE_D)
HALL1_IN: Hall_Effects.2 U13.3(A) ; port HALL1_IN
HALL1_TNC: U13.4(E) ; port HALL1_TNC
HALL2_IN: Hall_Effects.3 U13.6(B) ; port HALL2_IN
HALL2_TNC: U13.5(F) ; port HALL2_TNC
HALL_IN: Hall_Effects.4 U13.10(C) ; port HALL3_IN
HALL_TNC: U13.11(G) ; port HALL3_TNC
Sus_Pot_1: R10.2 Sus_Pot_1.2
Sus_Pot_2: R13.2 Sus_Pot_2.2
Sus_Pot_TNC_1: R10.1 R12.2 ; port Sus_pot_TNC_1
Sus_pot_TNC_2: R13.1 R46.2 ; port Sus_pot_TNC_2
NetC7_2: Hall_Effects.1 U13.1(VCC) U13.2(ENABLE_A) U13.7(ENABLE_B) U13.9(ENABLE_C) ; port Vbatt

Not connected (* = marked no-connect by the designer): U13 12(NC)* 13(H)* 14(D)*

### Library data of the parts
Hall_Effects = CMP-17439-000304-1: CONN HEADER VERT 5POS 2.5MM; Mated Stacking Heights: 9.8mm; Voltage Rating: 250V; Max Current Rating: 3A; Number of Positions: 5; Contact Resistance: 20mR; Depth: 5.75mm; Connector Type: Header; Color: Green; Insulation Material: Nylon; Contact Plating: Copper; Length: 14.9mm; Fastening Type: Detent; Contact Material: Brass; Number of Rows: 1; Contact Type: Male Pin; Housing Material: Polyamide; Housing Color: White; Lead Free: Lead Free; Max Voltage Rating (AC): 250V; Mount: Through Hole; Contact Shape: Square; Min Operating Temperature: -25°C; Packaging: Bulk; Orientation: Straight; Insulation Color: Natural; Series: XH; Flammability Rating: UL94 V-0; Contact Finish - Mating: TIN; Max Operating Temperature: 85°C; Termination: Solder; Pitch: 2.5mm
R10 R12 R13 R46 = CMP-2001-00877-1: Manufacturer: Panasonic; Part Number: ERA6AEB7870V
Sus_Pot_1 Sus_Pot_2 = CMP-17439-000014-3: as J5 on sheet frontbreakoutSchematic; Insulation Material: Nylon; Contact Plating: Tin; Depth: 5.75mm; Contact Type: Male Pin; Max Operating Temperature: 85°C; Insulation Color: Natural; Voltage Rating (AC): 250V; Color: Natural; Connector Type: Header; Orientation: Straight; Fastening Type: Detent; Housing Color: White; Min Operating Temperature: -25°C; Termination: Solder; Voltage Rating: 250V; Series: XH; Pitch: 2.5mm; Contact Shape: Square; Number of Rows: 1; Lead Free: Lead Free; Packaging: Bulk; Mount: Through Hole; Flammability Rating: UL94 V-0; Max Voltage Rating (AC): 250V; REACH SVHC: No SVHC; Housing Material: Polyamide; Contact Material: Brass; Lead Pitch: 2.5mm; Contact Finish - Mating: TIN; Length: 9.9mm; Max Current Rating: 3A; Number of Contacts: 3
U13 = CMP-1527-00005-2: CMOS Quad Low-to-High Voltage Level Shifter, 3 to 18 V, -55 to 125 degC, 16-Pin SO (NS16), RoHS, Tape and Reel; Manufacturer: Texas Instruments; Number of Channels: 4; VSS: 3 to 18 V; Propagation Delay: 240 ns Max.; ComponentLink2Description: Datasheet; PackageDescription: 16-Pin Plastic Small Outline Package, Body 10.2 x 5.3 mm, Pitch 1.27 mm; Mounting Technology: Surface Mount; Number of Outputs: 4; ComponentLink3URL: http://www.ti.com/lit/ml/msop002a/msop002a.pdf; Packing: Tape and Reel; RoHS: TRUE; Temperature Range: -55 to 125 degC; PartNumber: CD40109BNSR; PackageVersion: 4040062/C; ComponentLink3Description: Package Specification; DatasheetVersion: SCHS099B; ComponentLink2URL: http://www.ti.com/lit/ds/symlink/cd40109b.pdf; Package Reference: NS0016A; Number of Bits: 4; ComponentLink1Description: Manufacturer URL; ComponentLink1URL: www.ti.com

## Nets that join several sheets
3.3v: frontbreakoutSchematic (B1.42 B1.44 C10.2 U12.2), CAN (R1.2 U4.18), ssegs_and_registers (12 pins)
+5: frontbreakoutSchematic (C8.2 C9.2 U1.2 U12.3), CAN (U3.3)
GND: frontbreakoutSchematic (23 pins), CAN (C1.2 C2.2 U3.2 U4.9), ssegs_and_registers (12 pins), SEX (8 pins), moreConnectors (7 pins)
HALL1_TNC: frontbreakoutSchematic (B1.14), moreConnectors (U13.4)
HALL2_TNC: frontbreakoutSchematic (B1.15), moreConnectors (U13.5)
HALL_TNC: frontbreakoutSchematic (B1.16), moreConnectors (U13.11)
NetB1_1: frontbreakoutSchematic (B1.1), SEX (R39.2 U8.10)
NetB1_2: frontbreakoutSchematic (B1.2), SEX (R38.2 U8.5)
NetB1_3: frontbreakoutSchematic (B1.3), SEX (R43.2 U9.10)
NetB1_4: frontbreakoutSchematic (B1.4), SEX (R42.2 U9.5)
NetB1_5: frontbreakoutSchematic (B1.5), SEX (R40.2 U10.10)
NetB1_6: frontbreakoutSchematic (B1.6), SEX (R41.2 U10.5)
NetB1_7: frontbreakoutSchematic (B1.7), SEX (R45.2 U11.10)
NetB1_8: frontbreakoutSchematic (B1.8), SEX (R44.2 U11.5)
NetB1_9: frontbreakoutSchematic (B1.9), ssegs_and_registers (U2.12)
NetB1_10: frontbreakoutSchematic (B1.10), CAN (U4.16)
NetB1_11: frontbreakoutSchematic (B1.11), CAN (U4.14)
NetB1_12: frontbreakoutSchematic (B1.12), CAN (U4.15)
NetB1_13: frontbreakoutSchematic (B1.13), CAN (U4.13)
NetB1_17: frontbreakoutSchematic (B1.17), ssegs_and_registers (U6.12)
NetB1_18: frontbreakoutSchematic (B1.18), ssegs_and_registers (U6.11)
NetB1_19: frontbreakoutSchematic (B1.19), ssegs_and_registers (U6.14)
NetB1_20: frontbreakoutSchematic (B1.20), ssegs_and_registers (U5.12)
NetB1_21: frontbreakoutSchematic (B1.21), ssegs_and_registers (U5.11)
NetB1_22: frontbreakoutSchematic (B1.22), ssegs_and_registers (U5.14)
NetB1_23: frontbreakoutSchematic (B1.23), ssegs_and_registers (U7.12)
NetB1_24: frontbreakoutSchematic (B1.24), ssegs_and_registers (U7.11)
NetB1_25: frontbreakoutSchematic (B1.25), ssegs_and_registers (U7.14)
NetB1_32: frontbreakoutSchematic (B1.32), ssegs_and_registers (U2.14)
NetB1_33: frontbreakoutSchematic (B1.33), ssegs_and_registers (U2.11)
NetC7_2: frontbreakoutSchematic (C7.2 Can_&_Power.3 U1.3), moreConnectors (5 pins)
NetCan_&_Power_1: frontbreakoutSchematic (Can_&_Power.1), CAN (R11.1 U3.7)
NetCan_&_Power_2: frontbreakoutSchematic (Can_&_Power.2), CAN (J14.1 U3.6)
NetR2_2: ssegs_and_registers (R2.2), SEX (U8.9)
NetR3_2: ssegs_and_registers (R3.2), SEX (U10.9)
NetR4_2: ssegs_and_registers (R4.2), SEX (U8.8)
NetR5_2: ssegs_and_registers (R5.2), SEX (U10.8)
NetR6_2: ssegs_and_registers (R6.2), SEX (U8.1)
NetR7_2: ssegs_and_registers (R7.2), SEX (U10.1)
NetR8_2: ssegs_and_registers (R8.2), SEX (U8.4)
NetR9_2: ssegs_and_registers (R9.2), SEX (U10.4)
NetR14_2: ssegs_and_registers (R14.2), SEX (U8.3)
NetR15_2: ssegs_and_registers (R15.2), SEX (U10.3)
NetR16_2: ssegs_and_registers (R16.2), SEX (U8.6)
NetR17_2: ssegs_and_registers (R17.2), SEX (U10.6)
NetR18_2: ssegs_and_registers (R18.2), SEX (U8.7)
NetR19_2: ssegs_and_registers (R19.2), SEX (U10.7)
NetR20_2: ssegs_and_registers (R20.2), SEX (U8.2)
NetR21_2: ssegs_and_registers (R21.2), SEX (U10.2)
NetR22_2: ssegs_and_registers (R22.2), SEX (U9.9)
NetR23_2: ssegs_and_registers (R23.2), SEX (U11.9)
NetR24_2: ssegs_and_registers (R24.2), SEX (U9.8)
NetR25_2: ssegs_and_registers (R25.2), SEX (U11.8)
NetR26_2: ssegs_and_registers (R26.2), SEX (U9.1)
NetR27_2: ssegs_and_registers (R27.2), SEX (U11.1)
NetR28_2: ssegs_and_registers (R28.2), SEX (U9.4)
NetR29_2: ssegs_and_registers (R29.2), SEX (U11.4)
NetR30_2: ssegs_and_registers (R30.2), SEX (U9.3)
NetR31_2: ssegs_and_registers (R31.2), SEX (U11.3)
NetR32_2: ssegs_and_registers (R32.2), SEX (U9.6)
NetR33_2: ssegs_and_registers (R33.2), SEX (U11.6)
NetR34_2: ssegs_and_registers (R34.2), SEX (U9.7)
NetR35_2: ssegs_and_registers (R35.2), SEX (U11.7)
NetR36_2: ssegs_and_registers (R36.2), SEX (U9.2)
NetR37_2: ssegs_and_registers (R37.2), SEX (U11.2)
Sus_Pot_TNC_1: frontbreakoutSchematic (B1.26), moreConnectors (R10.1 R12.2)
Sus_pot_TNC_2: frontbreakoutSchematic (B1.27), moreConnectors (R13.1 R46.2)